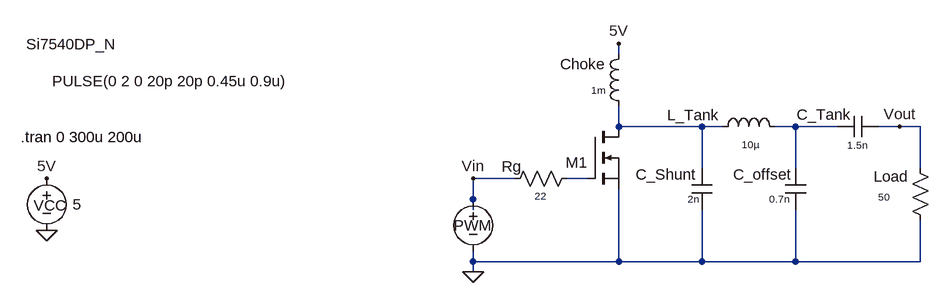
[diagram p0: schematic CLASS E Amplifier.asc]
CLASS E Amplifier.asc, the LTspice schematic file:
Version 4
SHEET 1 912 680
WIRE 256 -80 256 -96
WIRE 256 32 256 0
WIRE 384 32 256 32
WIRE 416 32 384 32
WIRE 528 32 496 32
WIRE 592 32 528 32
WIRE 688 32 656 32
WIRE 720 32 688 32
WIRE 384 96 384 32
WIRE 528 96 528 32
WIRE 720 96 720 32
WIRE 96 112 32 112
WIRE 208 112 176 112
WIRE 32 144 32 112
WIRE 32 160 32 144
WIRE 32 240 32 224
WIRE 256 240 256 128
WIRE 256 240 32 240
WIRE 384 240 384 160
WIRE 384 240 256 240
WIRE 528 240 528 160
WIRE 528 240 384 240
WIRE 720 240 720 176
WIRE 720 240 528 240
WIRE 32 256 32 240
FLAG 256 -96 5V
FLAG 688 32 Vout
FLAG -624 112 5V
FLAG -624 192 0
FLAG 32 112 Vin
FLAG 32 256 0
SYMBOL voltage 32 128 R0
WINDOW 123 0 0 Left 0
WINDOW 39 0 0 Left 0
WINDOW 0 -30 56 Left 2
WINDOW 3 -648 -166 Left 2
SYMATTR InstName PWM
SYMATTR Value PULSE(0 2 0 20p 20p 0.45u 0.9u)
SYMBOL voltage -624 96 R0
WINDOW 0 -20 57 Left 2
WINDOW 3 40 56 Left 2
WINDOW 123 0 0 Left 0
WINDOW 39 0 0 Left 0
SYMATTR InstName VCC
SYMATTR Value 5
SYMBOL nmos 208 32 R0
WINDOW 0 -34 55 Left 2
WINDOW 3 -864 -127 Left 2
SYMATTR InstName M1
SYMATTR Value Si7540DP_N
SYMBOL ind 400 48 R270
WINDOW 0 18 -29 VTop 2
WINDOW 3 -1 59 VBottom 1
SYMATTR InstName L_Tank
SYMATTR Value 10µ
SYMATTR SpiceLine Ipk=20
SYMBOL res 704 80 R0
WINDOW 0 -56 29 Left 2
WINDOW 3 -49 60 Left 1
SYMATTR InstName Load
SYMATTR Value 50
SYMBOL cap 656 16 R90
WINDOW 0 13 84 VBottom 2
WINDOW 3 34 33 VTop 1
SYMATTR InstName C_Tank
SYMATTR Value 1.5n
SYMATTR SpiceLine Rpar=0
SYMBOL cap 368 96 R0
WINDOW 0 -86 10 Left 2
WINDOW 3 -6 47 Left 1
SYMATTR InstName C_Shunt
SYMATTR Value 2n
SYMBOL ind 272 16 R180
WINDOW 0 36 80 Left 2
WINDOW 3 36 40 Left 1
SYMATTR InstName Choke
SYMATTR Value 1m
SYMATTR SpiceLine Ipk=50 Rser=0.1 Cpar=0
SYMBOL cap 544 160 R180
WINDOW 0 22 54 Left 2
WINDOW 3 25 17 Left 1
SYMATTR InstName C_offset
SYMATTR Value 0.7n
SYMATTR SpiceLine Rpar=0
SYMBOL res 192 96 R90
WINDOW 0 13 101 VBottom 2
WINDOW 3 32 56 VTop 1
SYMATTR InstName Rg
SYMATTR Value 22
TEXT -664 48 Left 2 !.tran 0 300u 200u

The netlist it stands for:
* CLASS E Amplifier.asc
V§PWM Vin 0 PULSE(0 2 0 20p 20p 0.45u 0.9u)
VCC 5V 0 5
M1 N001 N003 0 0 Si7540DP_N
L_Tank N001 N002 10µ Ipk=20
R§Load Vout 0 50
C_Tank Vout N002 1.5n Rpar=0
C_Shunt N001 0 2n
L§Choke N001 5V 1m Ipk=50 Rser=0.1 Cpar=0
C_offset 0 N002 0.7n Rpar=0
Rg N003 Vin 22
.model NMOS NMOS
.model PMOS PMOS
.lib standard.mos
.tran 0 300u 200u
.backanno
.end